# Altium schematic sheet LCD - Copy.SchDoc
size B
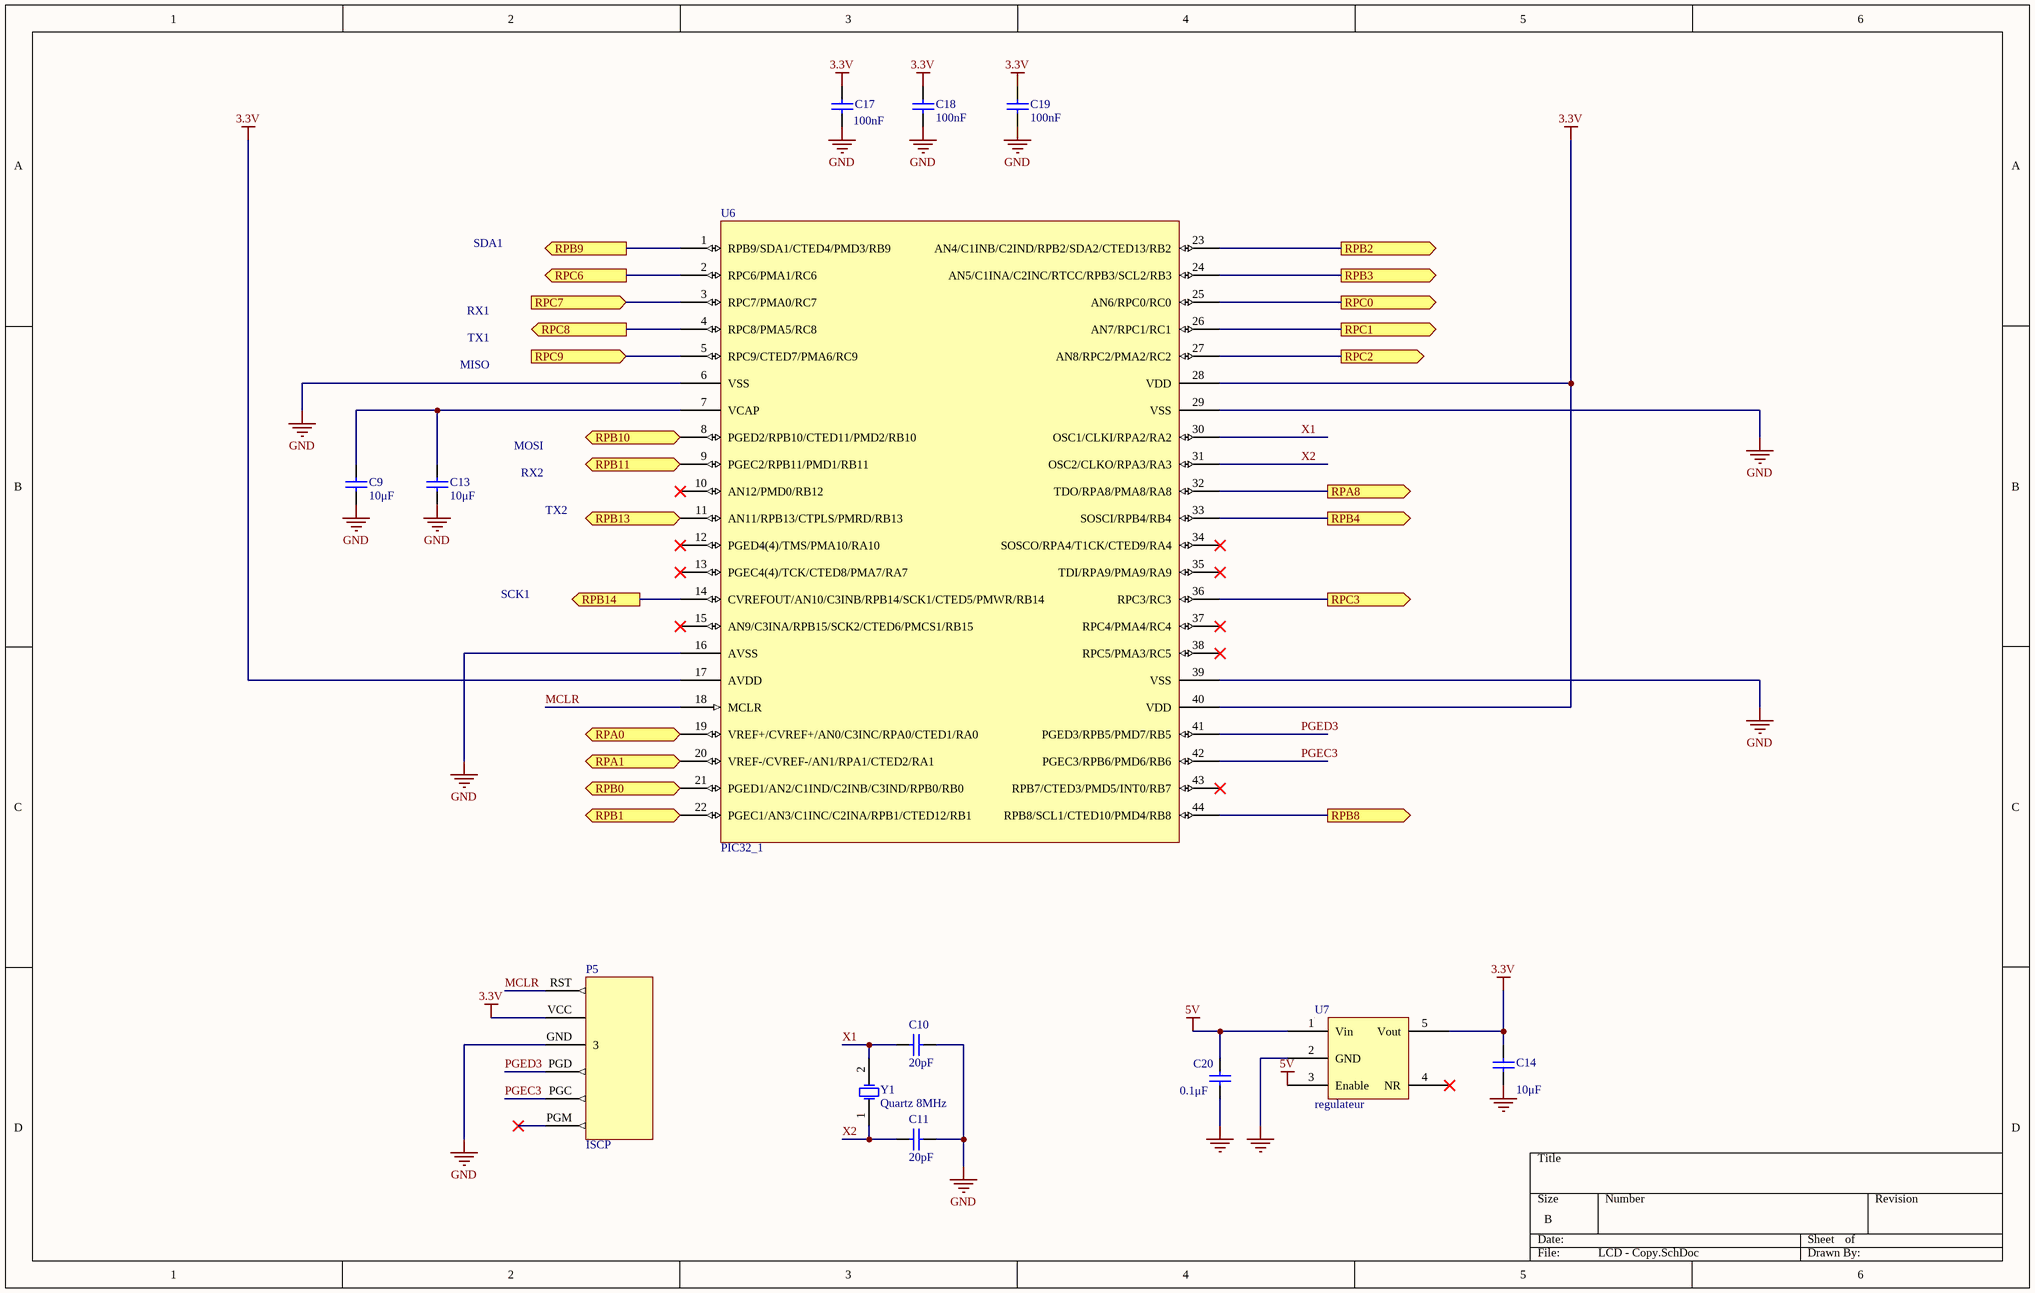
[diagram p0: LCD - Copy.SchDoc]

## Parts
C9  value 10μF  [cond]  (hidden comment: Cap)
C10  value 20pF  [cond]  (hidden comment: Cap)
C11  value 20pF  [cond]  (hidden comment: Cap)
C13  value 10μF  [cond]  (hidden comment: Cap)
C14  value 10μF  [cond]  (hidden comment: Cap)
C17  value 100nF  [cond]  (hidden comment: Cap)
C18  value 100nF  [cond]  (hidden comment: Cap)
C19  value 100nF  [cond]  (hidden comment: Cap)
C20  value 0.1μF  [cond]  (hidden comment: Cap)
P5  ISCP  [ISCP]
U6  PIC32_1
U7  regulateur  [regulateur]
Y1  Quartz 8MHz  [quartz]

## Ports
RPA0 (out), RPA1 (out), RPA8 (out), RPB0 (out), RPB1 (out), RPB2 (out), RPB3 (out), RPB4 (out), RPB8 (out), RPB9 (out), RPB10 (out), RPB11 (in), RPB13 (out), RPB14 (out), RPC0 (out), RPC1 (out), RPC2 (out), RPC3 (out), RPC6 (out), RPC7 (in), RPC8 (out), RPC9 (in)

## Nets
3.3V: C14.2 C17.2 C18.1 C19.1 P5.VCC U6.17(AVDD) U6.28(VDD) U6.40(VDD) U7.5(Vout)
5V: C20.2 U7.1(Vin) U7.3(Enable)
GND: C9.2 C10.1 C11.1 C13.2 C14.1 C17.1 C18.2 C19.2 C20.1 P5.GND(3) U6.6(VSS) U6.16(AVSS) U6.29(VSS) U6.39(VSS) U7.2(GND)
MCLR: P5.RST U6.18(MCLR)
PGEC3: P5.PGC U6.42(PGEC3/RPB6/PMD6/RB6)
PGED3: P5.PGD U6.41(PGED3/RPB5/PMD7/RB5)
RPA0: U6.19(VREF+/CVREF+/AN0/C3INC/RPA0/CTED1/RA0) ; port RPA0
RPA1: U6.20(VREF-/CVREF-/AN1/RPA1/CTED2/RA1) ; port RPA1
RPA8: U6.32(TDO/RPA8/PMA8/RA8) ; port RPA8
RPB0: U6.21(PGED1/AN2/C1IND/C2INB/C3IND/RPB0/RB0) ; port RPB0
RPB1: U6.22(PGEC1/AN3/C1INC/C2INA/RPB1/CTED12/RB1) ; port RPB1
RPB2: U6.23(AN4/C1INB/C2IND/RPB2/SDA2/CTED13/RB2) ; port RPB2
RPB3: U6.24(AN5/C1INA/C2INC/RTCC/RPB3/SCL2/RB3) ; port RPB3
RPB4: U6.33(SOSCI/RPB4/RB4) ; port RPB4
RPB8: U6.44(RPB8/SCL1/CTED10/PMD4/RB8) ; port RPB8
RPB9: U6.1(RPB9/SDA1/CTED4/PMD3/RB9) ; port RPB9
RPB10: U6.8(PGED2/RPB10/CTED11/PMD2/RB10) ; port RPB10
RPB11: U6.9(PGEC2/RPB11/PMD1/RB11) ; port RPB11
RPB13: U6.11(AN11/RPB13/CTPLS/PMRD/RB13) ; port RPB13
RPB14: U6.14(CVREFOUT/AN10/C3INB/RPB14/SCK1/CTED5/PMWR/RB14) ; port RPB14
RPC0: U6.25(AN6/RPC0/RC0) ; port RPC0
RPC1: U6.26(AN7/RPC1/RC1) ; port RPC1
RPC2: U6.27(AN8/RPC2/PMA2/RC2) ; port RPC2
RPC3: U6.36(RPC3/RC3) ; port RPC3
RPC6: U6.2(RPC6/PMA1/RC6) ; port RPC6
RPC7: U6.3(RPC7/PMA0/RC7) ; port RPC7
RPC8: U6.4(RPC8/PMA5/RC8) ; port RPC8
RPC9: U6.5(RPC9/CTED7/PMA6/RC9) ; port RPC9
X1: C10.2 U6.30(OSC1/CLKI/RPA2/RA2) Y1.2(OSC2)
X2: C11.2 U6.31(OSC2/CLKO/RPA3/RA3) Y1.1(OSC1)
NetC9_1: C9.1 C13.1 U6.7(VCAP)

Not connected (* = marked no-connect by the designer): P5 PGM(6)*; U6 10(AN12/PMD0/RB12)* 12(PGED4(4)/TMS/PMA10/RA10)* 13(PGEC4(4)/TCK/CTED8/PMA7/RA7)* 15(AN9/C3INA/RPB15/SCK2/CTED6/PMCS1/RB15)* 34(SOSCO/RPA4/T1CK/CTED9/RA4)* 35(TDI/RPA9/PMA9/RA9)* 37(RPC4/PMA4/RC4)* 38(RPC5/PMA3/RC5)* 43(RPB7/CTED3/PMD5/INT0/RB7)*; U7 4(NR)*

## Notes on the sheet
- SDA1
- RX1
- MISO
- TX1
- MOSI
- RX2
- TX2
- SCK1

## Library data of the parts
C9-C11 C13 C14 C17-C20 = Cap: Capacitor; Published: 8-Jun-2000; LatestRevisionDate: 17-Jul-2002; LatestRevisionNote: Re-released for DXP Platform.; PackageReference: RAD-0.3; Publisher: Altium Limited; PackageDescription: Radial Cap, Thru-Hole; 2 Leads; 0.3 in Pin Spacing
U7 = regulateur: FABRIQUANT: TI; FOURNISSEUR: FARNELL; REF FABRIQUANT: REG102NA-3.3/250; REF FOURNISSEUR: 2323575
Y1 = XTAL: Crystal Oscillator; FABRIQUANT: TXC; FOURNISSEUR: FARNELL; REF FABRIQUANT: AS-8.000MAHK-B; REF FOURNISSEUR: 2142512; Published: 8-Jun-2000; LatestRevisionDate: 17-Jul-2002; LatestRevisionNote: Re-released for DXP Platform.; PackageReference: R38; Publisher: Altium Limited; PackageDescription: Crystal, Thru-Hole; 2 Leads; Body 3.1 x 8.2 mm (Dia.xH)